# Altium schematic sheet Sheet1.SchDoc
size A
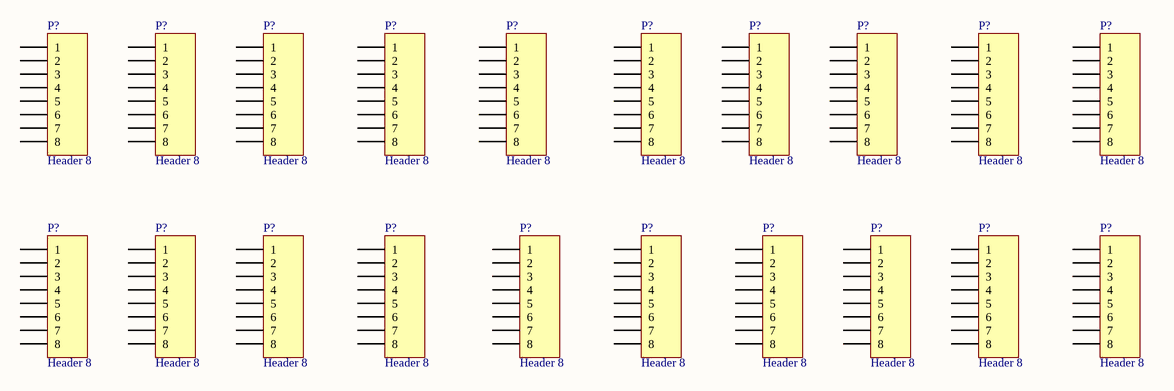
[diagram p0: Sheet1.SchDoc]

## Parts
(Parts that share a designator on the sheet are numbered #1, #2 ... from top to bottom, then left to right.)
P?#1  Header 8  [HDR1X8]
P?#2  Header 8  [HDR1X8]
P?#3  Header 8  [HDR1X8]
P?#4  Header 8  [HDR1X8]
P?#5  Header 8  [HDR1X8]
P?#6  Header 8  [HDR1X8]
P?#7  Header 8  [HDR1X8]
P?#8  Header 8  [HDR1X8]
P?#9  Header 8  [HDR1X8]
P?#10  Header 8  [HDR1X8]
P?#11  Header 8  [HDR1X8]
P?#12  Header 8  [HDR1X8]
P?#13  Header 8  [HDR1X8]
P?#14  Header 8  [HDR1X8]
P?#15  Header 8  [HDR1X8]
P?#16  Header 8  [HDR1X8]
P?#17  Header 8  [HDR1X8]
P?#18  Header 8  [HDR1X8]
P?#19  Header 8  [HDR1X8]
P?#20  Header 8  [HDR1X8]

## Nets

Not connected (* = marked no-connect by the designer): P?#1 1 2 3 4 5 6 7 8; P?#2 1 2 3 4 5 6 7 8; P?#3 1 2 3 4 5 6 7 8; P?#4 1 2 3 4 5 6 7 8; P?#5 1 2 3 4 5 6 7 8; P?#6 1 2 3 4 5 6 7 8; P?#7 1 2 3 4 5 6 7 8; P?#8 1 2 3 4 5 6 7 8; P?#9 1 2 3 4 5 6 7 8; P?#10 1 2 3 4 5 6 7 8; P?#11 1 2 3 4 5 6 7 8; P?#12 1 2 3 4 5 6 7 8; P?#13 1 2 3 4 5 6 7 8; P?#14 1 2 3 4 5 6 7 8; P?#15 1 2 3 4 5 6 7 8; P?#16 1 2 3 4 5 6 7 8; P?#17 1 2 3 4 5 6 7 8; P?#18 1 2 3 4 5 6 7 8; P?#19 1 2 3 4 5 6 7 8; P?#20 1 2 3 4 5 6 7 8

## Library data of the parts
P?#1-P?#20 = Header 8: Header, 8-Pin; LatestRevisionDate: 17-Jul-2002; LatestRevisionNote: Re-released for DXP Platform.; Publisher: Altium Limited